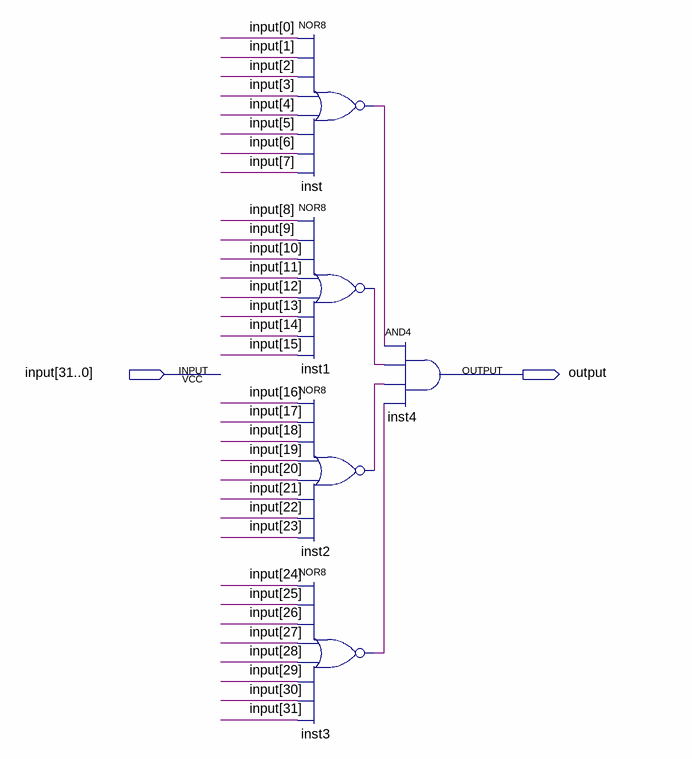
[diagram p0: schematic sheet]
// Quartus schematic ZeroChecker.bdf as structural Verilog: 5 symbols, 2 pins
module ZeroChecker (
  input  [31:0] \input ,
  output \output 
);

  wire inst1_out, inst2_out, inst3_out, inst_out;

  nor inst (inst_out, \input [0], \input [1], \input [2], \input [3], \input [4], \input [5], \input [6], \input [7]);
  nor inst1 (inst1_out, \input [8], \input [9], \input [10], \input [11], \input [12], \input [13], \input [14], \input [15]);
  nor inst2 (inst2_out, \input [16], \input [17], \input [18], \input [19], \input [20], \input [21], \input [22], \input [23]);
  nor inst3 (inst3_out, \input [24], \input [25], \input [26], \input [27], \input [28], \input [29], \input [30], \input [31]);
  and inst4 (\output , inst_out, inst1_out, inst2_out, inst3_out);
endmodule
